# EAGLE design signal-board (EAGLE 9.6.2)
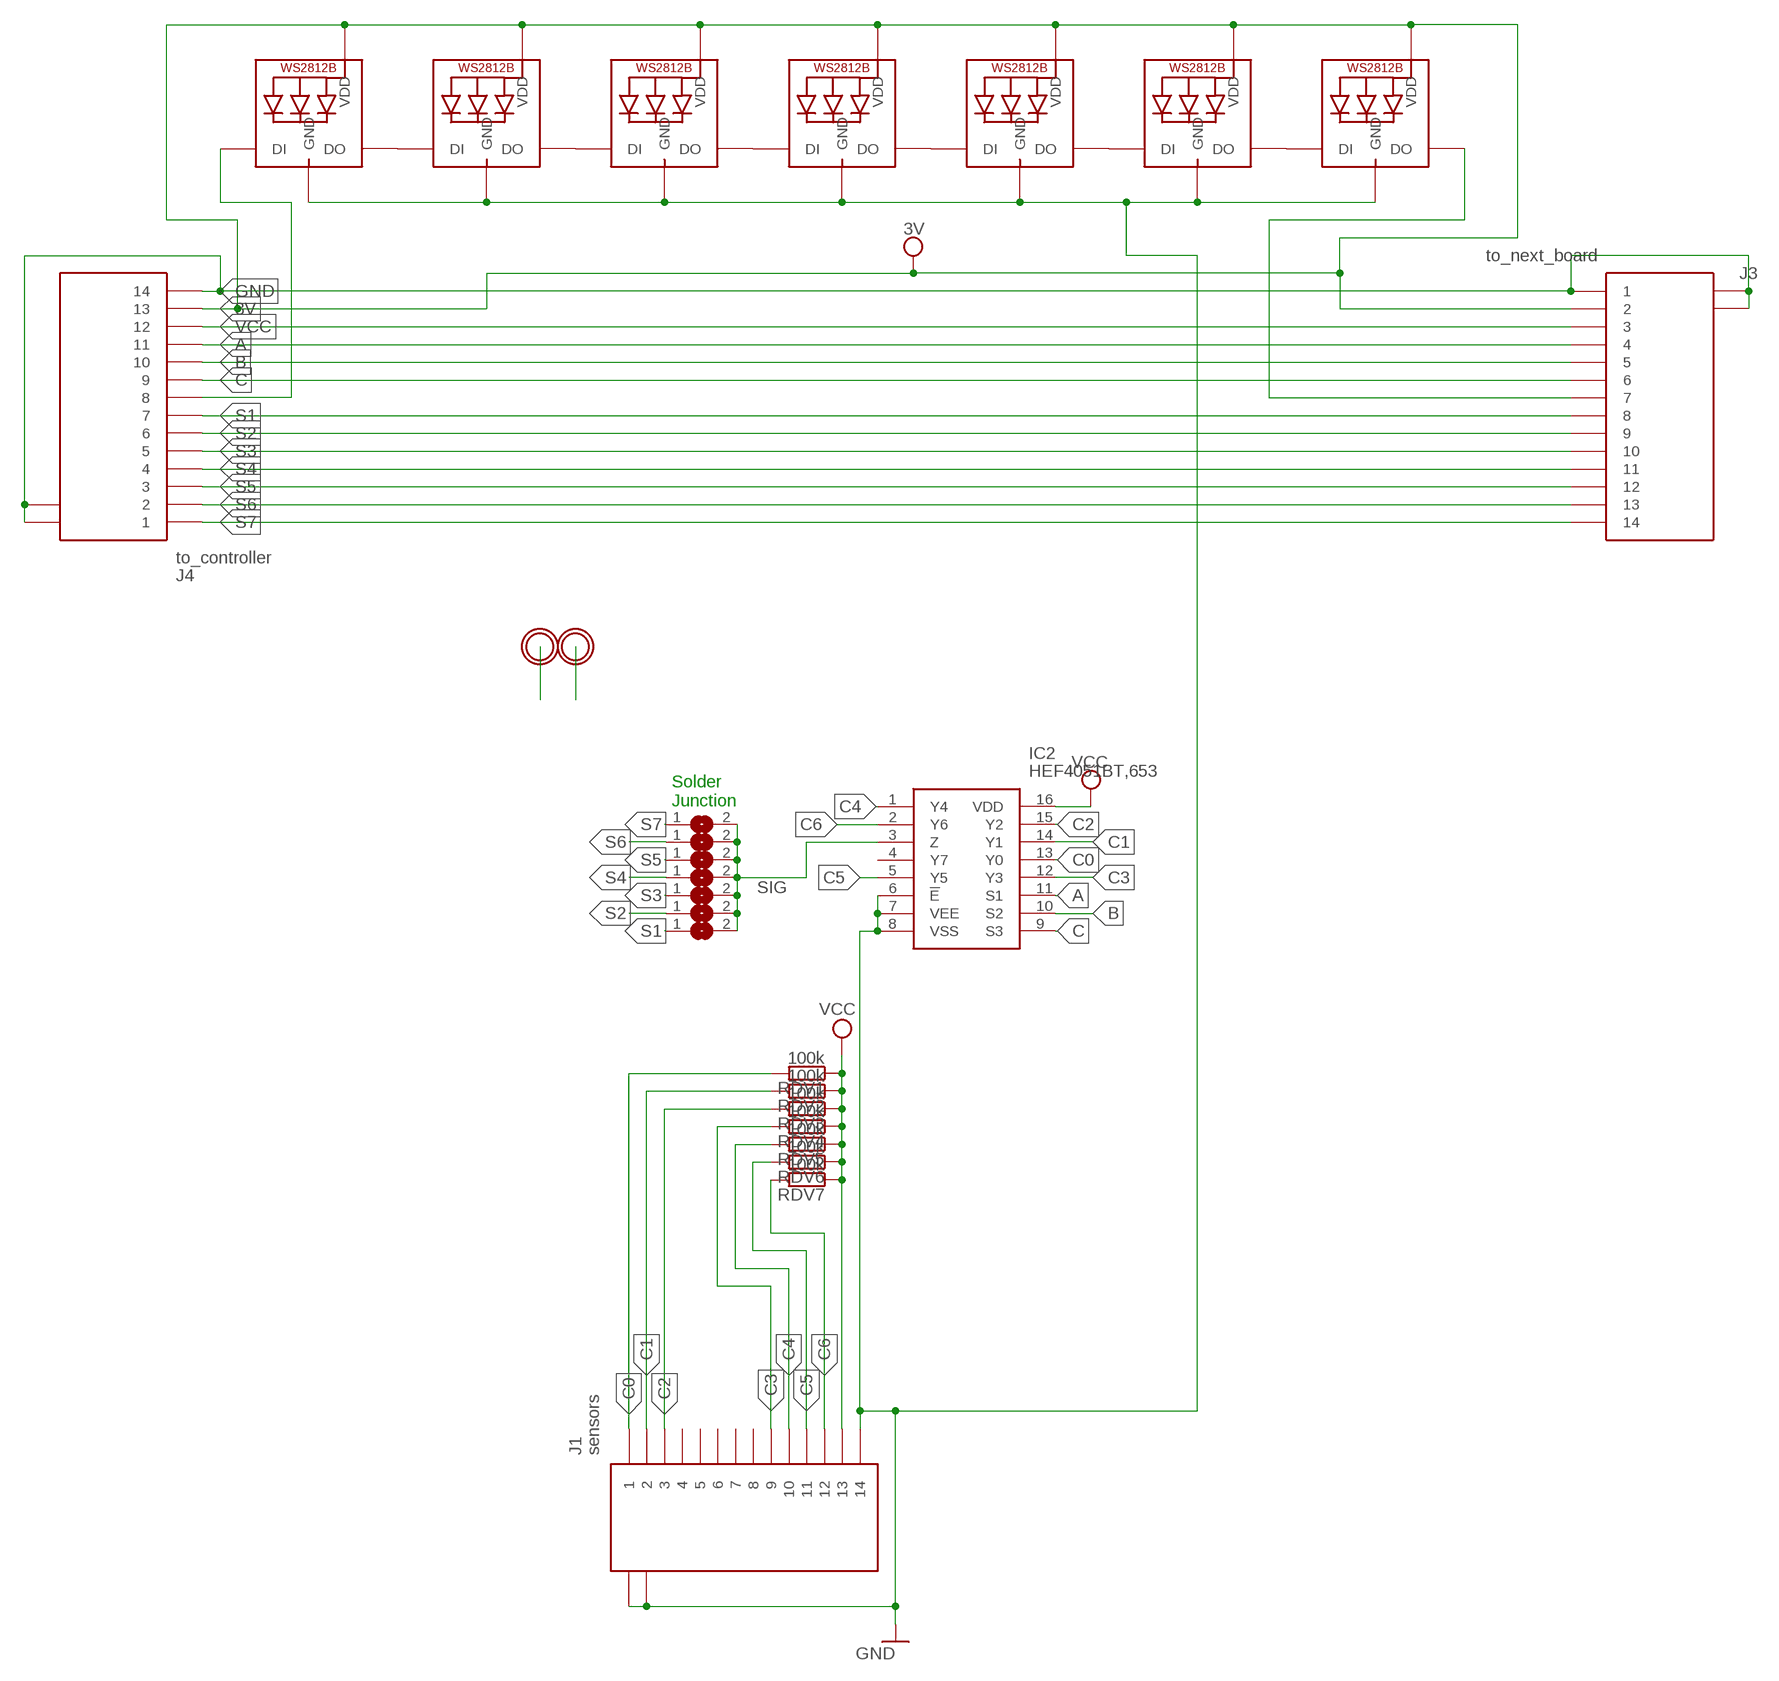
[diagram p0: schematic, sheet 1]

## Parts
IC2  HEF4051BT,653  [HEF4051BT653]
J1  sensors  686114148922  [686114148922]
J3  to_next_board  686114148922  [686114148922]
J4  to_controller  686114148922  [686114148922]
LED1  WS2812B3535  [LED3535]
LED2  WS2812B3535  [LED3535]
LED3  WS2812B3535  [LED3535]
LED4  WS2812B3535  [LED3535]
LED5  WS2812B3535  [LED3535]
LED6  WS2812B3535  [LED3535]
LED7  WS2812B3535  [LED3535]
RDV1  100k  R-EU_R0805  [R0805]
RDV2  100k  R-EU_R0805  [R0805]
RDV3  100k  R-EU_R0805  [R0805]
RDV4  100k  R-EU_R0805  [R0805]
RDV5  100k  R-EU_R0805  [R0805]
RDV6  100k  R-EU_R0805  [R0805]
RDV7  100k  R-EU_R0805  [R0805]
SJ1  SJ  [SJ]
SJ2  SJ  [SJ]
SJ3  SJ  [SJ]
SJ4  SJ  [SJ]
SJ5  SJ  [SJ]
SJ6  SJ  [SJ]
SJ7  SJ  [SJ]
U$1  MICROBUILDER_MOUNTINGHOLEMICROBUILDER_MOUNTINGHOL_4.0  [MICROBUILDER_MOUNTINGHOLE_4.0_PLATEDTHIN]
U$2  MICROBUILDER_MOUNTINGHOLEMICROBUILDER_MOUNTINGHOL_4.0  [MICROBUILDER_MOUNTINGHOLE_4.0_PLATEDTHIN]

## Nets
3V: J3.2 J4.13 LED1.2(VDD) LED2.2(VDD) LED3.2(VDD) LED4.2(VDD) LED5.2(VDD) LED6.2(VDD) LED7.2(VDD)
A: IC2.11(S1) J3.4 J4.11
B: IC2.10(S2) J3.5 J4.10
C: IC2.9(S3) J3.6 J4.9
C0: IC2.13(Y0) J1.1 RDV1.2
C1: IC2.14(Y1) J1.2 RDV2.2
C2: IC2.15(Y2) J1.3 RDV3.2
C3: IC2.12(Y3) J1.9 RDV4.2
C4: IC2.1(Y4) J1.10 RDV5.2
C5: IC2.5(Y5) J1.11 RDV6.2
C6: IC2.2(Y6) J1.12 RDV7.2
DIN: J4.8 LED1.1(DI)
DOUT: J3.7 LED7.3(DO)
GND: IC2.6(!E) IC2.7(VEE) IC2.8(VSS) J1.14 J1.MP1 J1.MP2 J3.1 J3.MP1 J3.MP2 J4.14 J4.MP1 J4.MP2 LED1.4(GND) LED2.4(GND) LED3.4(GND) LED4.4(GND) LED5.4(GND) LED6.4(GND) LED7.4(GND)
N$1: LED1.3(DO) LED2.1(DI)
N$2: LED2.3(DO) LED3.1(DI)
N$3: LED3.3(DO) LED4.1(DI)
N$4: LED4.3(DO) LED5.1(DI)
N$5: LED5.3(DO) LED6.1(DI)
N$6: LED6.3(DO) LED7.1(DI)
S1: J3.8 J4.7 SJ1.1
S2: J3.9 J4.6 SJ2.1
S3: J3.10 J4.5 SJ3.1
S4: J3.11 J4.4 SJ4.1
S5: J3.12 J4.3 SJ5.1
S6: J3.13 J4.2 SJ6.1
S7: J3.14 J4.1 SJ7.1
SIG: IC2.3(Z) SJ1.2 SJ2.2 SJ3.2 SJ4.2 SJ5.2 SJ6.2 SJ7.2
VCC: IC2.16(VDD) J1.13 J3.3 J4.12 RDV1.1 RDV2.1 RDV3.1 RDV4.1 RDV5.1 RDV6.1 RDV7.1
Unconnected: IC2.4(Y7) J1.4 J1.5 J1.6 J1.7 J1.8

## Notes on the sheet
- Solder
  Junction

## Library data of the parts
IC2 = HEF4051BT_653:HEF4051BT,653: HEF4051B - 8-channel analog multiplexer/demultiplexer@en-us Source: Datasheet <https://assets.nexperia.com/documents/data-sheet/HEF4051B.pdf>; DESCRIPTION: HEF4051B - 8-channel analog multiplexer/demultiplexer@en-us; HEIGHT: 1.75mm; MANUFACTURER_NAME: Nexperia; MANUFACTURER_PART_NUMBER: HEF4051BT,653; MOUSER_PART_NUMBER: 771-HEF4051BTD-T; MOUSER_PRICE-STOCK: https://www.mouser.co.uk/ProductDetail/Nexperia/HEF4051BT653?qs=me8TqzrmIYWoNumSZf8zVw%3D%3D
J1 J3 J4 = 686114148922:686114148922: Wurth Elektronik WR-FPC 1mm Pitch 14 Way Horizontal SMT Female FPC Connector, ZIF Bottom Contact Source: Datasheet <https://www.we-online.com/catalog/datasheet/686114148922.pdf>; DESCRIPTION: Wurth Elektronik WR-FPC 1mm Pitch 14 Way Horizontal SMT Female FPC Connector, ZIF Bottom Contact; HEIGHT: 2.3mm; MANUFACTURER_NAME: Wurth Elektronik; MANUFACTURER_PART_NUMBER: 686114148922; MOUSER_PART_NUMBER: 710-686114148922; MOUSER_PRICE-STOCK: https://www.mouser.co.uk/ProductDetail/Wurth-Elektronik/686114148922?qs=a9WhcLg8qCz0mPj5zZqo5g%3D%3D
LED1-LED7 = adafruit:WS2812B
RDV1-RDV7 = rcl:R-EU_: RESISTOR, European symbol; SPICEPREFIX: R
SJ1-SJ7 = jumper:SJ: SMD solder JUMPER
U$1 U$2 = microbuilder:MICROBUILDER_MOUNTINGHOLE: Mounting Hole For #2 screws (0.086"/2.18mm width, 0.094"/2.4mm hole) use 2.5mm

## Board
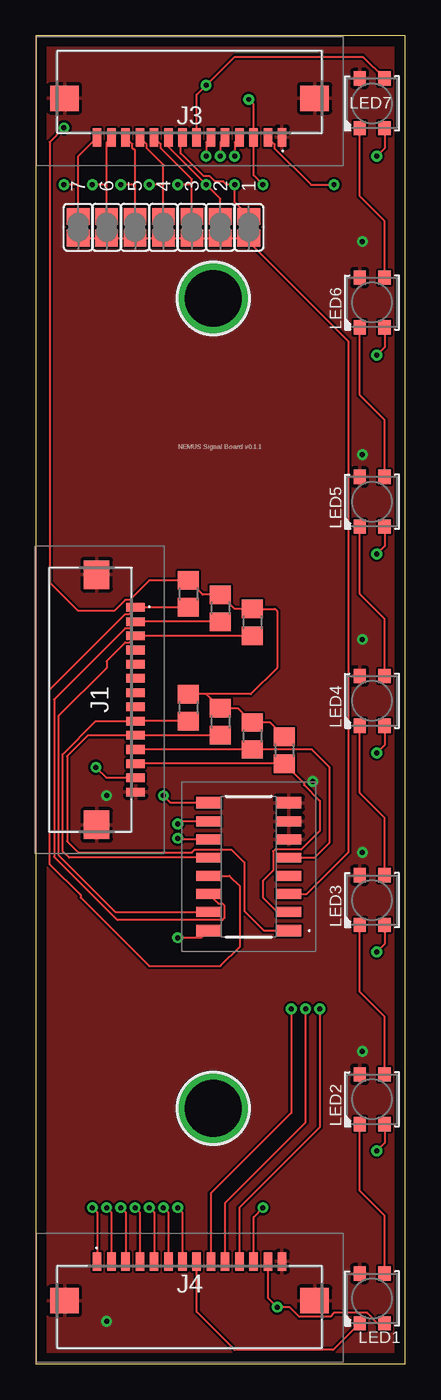
[diagram p1: board, top side]
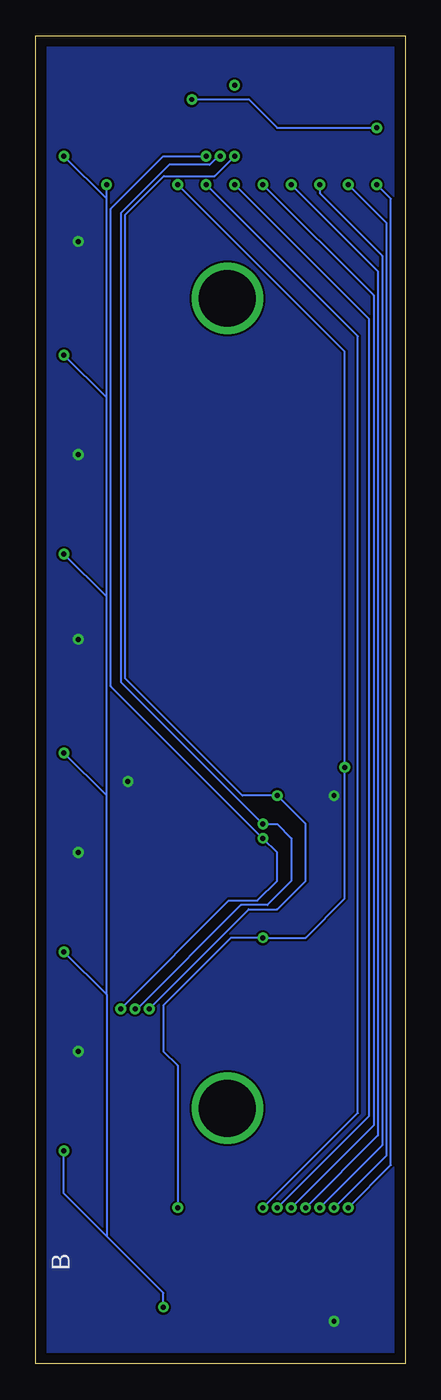
[diagram p2: board, bottom side, seen from below]

Size 26 x 93.5 mm. Coordinates in mm from the lower left corner, seen from the top.
Outline: 0,0 26,0 26,93.5 0,93.5 0,0
Copper layers (1*16): Top 0.035mm / dielectric 1.5mm / Bottom 0.035mm
Design rules "default *": minimum track width 6mil, minimum drill 0.35mm, track to track 6mil, track to pad 6mil, pad to pad 6mil, via to via 6mil, smd to smd 6mil, copper to edge 30mil, drill to drill 6mil, minimum pad ring 10mil, minimum via ring 8mil, stop-mask expansion 4mil, vias tented up to drill 0mil, thermal gap 10mil

### Footprints (pad centres in the part's own frame; a part is rotated, then mirrored left to right if it is on the bottom)
HEF4051BT653 = smd 0.8 x 1.75: 1 -4.495,-2.825; 8 4.495,-2.825; 9 4.495,2.825; 16 -4.495,2.825 | smd 0.7 x 1.75: 2 -3.175,-2.825; 3 -1.905,-2.825; 4 -0.635,-2.825; 5 0.635,-2.825; 6 1.905,-2.825; 7 3.175,-2.825; 10 3.175,2.825; 11 1.905,2.825; 12 0.635,2.825; 13 -0.635,2.825; 14 -1.905,2.825; 15 -3.175,2.825
686114148922 = smd 0.6 x 1.3: 1 -6.5,3.05; 2 -5.5,3.05; 3 -4.5,3.05; 4 -3.5,3.05; 5 -2.5,3.05; 6 -1.5,3.05; 7 -0.5,3.05; 8 0.5,3.05; 9 1.5,3.05; 10 2.5,3.05; 11 3.5,3.05; 12 4.5,3.05; 13 5.5,3.05; 14 6.5,3.05 | smd 2 x 1.8: MP1 -8.8,0.3; MP2 8.8,0.3
LED3535 = smd 1 x 0.85: 1 -1.75,0.875; 2 -1.75,-0.875; 3 1.75,-0.875; 4 1.75,0.875
R0805 = smd 1.3 x 1.5: 1 -0.95,0; 2 0.95,0
SJ = smd 1.168 x 1.6: 1 -0.762,0; 2 0.762,0
MICROBUILDER_MOUNTINGHOLE_4.0_PLATEDTHIN = drill 4 pad 4.6: P$1 0,0

### Placement (x,y rotation side)
IC2  15,35 90 top
J1  4,46.75 270 top
J3  10.84,89.38 180 top
J4  10.84,4.16 0 top
LED1  23.68,4.61 90 top
LED2  23.68,18.63 90 top
LED3  23.68,32.65 90 top
LED4  23.68,46.67 90 top
LED5  23.68,60.69 90 top
LED6  23.68,74.71 90 top
LED7  23.68,88.73 90 top
RDV1  10.75,54.2 270 top
RDV2  13,53.2 270 top
RDV3  15.25,52.2 270 top
RDV4  10.75,46.2 270 top
RDV5  13,45.2 270 top
RDV6  15.25,44.2 270 top
RDV7  17.5,43.2 270 top
SJ1  15,80 270 top
SJ2  13,80 270 top
SJ3  11,80 270 top
SJ4  9,80 270 top
SJ5  7,80 270 top
SJ6  5,80 270 top
SJ7  3,80 270 top
U$1  12.5,75 0 top
U$2  12.5,18 0 top

### Tracks (layer width: path | path; a pad name or v marks a point on that pad's centre or on a via)
3V  (via drill 0.35)
  Top 0.152: J4.13 16.34,4.66 v17,4 17.88,4 18.55,3.33 20.73,3.33 20.99,3.59 23.32,3.59 24.05,2.86 LED1.2 | J3.2 16.81,85.86 16.81,85.58 19.4,83 v21,83 | LED2.2 24.55,15.55 v24,15 | LED3.2 24.55,29.55 v24,29 | LED4.2 24.55,43.55 v24,43 | LED5.2 24.55,57.55 v24,57 | LED6.2 24.55,71.56 v24,71 | LED7.2 24.55,85.56 v24,85
  Bottom 0.152: 21,26 21,40 | 21,40 21,54 | 21,54 21,68 | 21,68 21,82 | 21,82 v21,83 | v24,15 24,12 21,9 | v24,29 21,26 | v24,43 21,40 | v24,57 21,54 | v24,71 21,68 | v24,85 21,82 | v17,4 17,5 21,9 | 21,26 21,9
A  (via drill 0.35)
  Top 0.152: IC2.11 10.1,36.91 v10,37 | J4.11 14.34,11 20,16.66 v20,25 | J3.4 14,85.99 v14,85
  Bottom 0.152: v14,85 17,85 20.7,81.31 20.7,47.7 v10,37 9,36 9,34 10.39,32.61 12.39,32.61 v20,25
B  (via drill 0.35)
  Top 0.152: IC2.10 10.18,38.17 v10,38 | J3.5 13,85.99 v13,85 | v19,25 19,17 13.34,11.34 J4.10
  Bottom 0.152: v19,25 18.86,25 11.55,32.3 9.7,32.3 8,34 8,37 9,38 v10,38 20,48 20,81 16.61,84.39 13.75,84.39 13.14,85 v13,85
C  (via drill 0.35)
  Top 0.152: IC2.9 9.51,39.49 v9,40 | J4.9 12.34,12 18,17.66 v18,25 | J3.6 12,85.99 v12,85
  Bottom 0.152: v18,25 11,32 9,32 7,34 7,38 v9,40 11.45,40 19.7,48.25 19.7,80.87 16.96,83.61 13.39,83.61 v12,85
C0
  Top 0.152: RDV1.2 J1.1 6.58,52.78 6.3,52.78 1,47.47 1,35.17 3.17,33 3.17,32.83 8,28 13,28 14.39,29.39 14.39,33.61 13.63,34.37 IC2.13
C1
  Top 0.152: RDV2.2 J1.2 6.58,51.78 6.3,51.78 1.3,46.78 1.3,35.7 5.75,31.25 13.14,31.25 13.28,31.38 13.28,32.27 13.14,32.4 12.87,32.4 IC2.14
C2
  Top 0.152: RDV3.2 J1.3 6.58,50.78 6.3,50.78 5,49.47 5,49 1.61,45.61 1.61,35.82 5.61,31.82 IC2.15
C3
  Top 0.152: RDV4.2 J1.9 4.25,45.25 1.91,42.91 1.91,36.09 2.37,35.63 IC2.12
C4
  Top 0.152: RDV5.2 J1.10 3.68,44.25 2.22,42.79 2.22,36.78 3,36 10.99,36 11.21,36.21 13.79,36.21 14.7,35.3 14.7,31.87 16.06,30.5 IC2.1
C5
  Top 0.152: J1.11 RDV6.2 19.45,43.25 20.7,42 20.7,36.7 19.64,35.63 IC2.5
C6
  Top 0.152: J1.12 RDV7.2 18.89,40.86 18.89,40.75 20,39.64 20,37.53 18.68,36.21 16.86,36.21 16.72,36.08 16.72,34.72 16,34 16,32.83 17,31.82 IC2.2
DIN
  Top 0.152: LED1.1 20.95,1 14,1 11.34,3.66 J4.8
DOUT  (via drill 0.35)
  Top 0.152: J3.7 11.34,89.34 v12,90 14,92 23.04,92 LED7.3
GND  (via drill 0.35)
  other vias: 5,40 19.5,41 23,22 23,36 5,3 23,64 23,79 23,51
  pour Top: 0,93.5 26,93.5 26,0 0,0
  pour Bottom: 26,93.5 0,93.5 0,0 26,0
N$1
  Top 0.152: LED1.3 24.55,10.45 22.8,12.2 LED2.1
N$2
  Top 0.152: LED2.3 24.55,24.45 22.8,26.2 LED3.1
N$3
  Top 0.152: LED3.3 24.55,38.45 22.8,40.2 LED4.1
N$4
  Top 0.152: LED4.3 24.55,52.45 22.8,54.2 LED5.1
N$5
  Top 0.152: LED5.3 24.55,66.44 22.8,68.19 LED6.1
N$6
  Top 0.152: LED6.3 24.55,80.44 22.8,82.19 LED7.1
S1  (via drill 0.35)
  Top 0.152: v10,11 10.34,10.66 J4.7 | SJ1.1 14,81.76 v14,83 13.43,83 13.22,83.22 12.64,83.22 12.25,83.61 11.82,83.61 10.22,85.22 10.22,86.21 J3.8
  Bottom 0.152: v10,11 3.33,17.67 3.33,72.33 v14,83
S2  (via drill 0.35)
  Top 0.152: SJ2.1 13,82 v12,83 9.34,85.66 J3.9 | v9,11 9.34,10.66 J4.6
  Bottom 0.152: v9,11 2.52,17.48 2.52,73.52 v12,83
S3  (via drill 0.35)
  Top 0.152: J3.10 8.81,85.86 8.81,85.58 11,83.4 11,83 | SJ3.1 11,83 | 11,83 v10,83 | v8,11 8.34,10.66 J4.5
  Bottom 0.152: v8,11 2.22,16.78 2.22,75.22 v10,83
S4  (via drill 0.35)
  Top 0.152: J3.11 7.81,85.86 7.81,85.58 9,84.4 9,83 | SJ4.1 9,83 | 9,83 v8,83 | v7,11 7.34,10.66 J4.4
  Bottom 0.152: v7,11 1.91,16.09 1.91,76.91 v8,83
S5  (via drill 0.35)
  Top 0.152: J3.12 6.81,85.86 6.81,85.58 7,85.4 7,83 | SJ5.1 7,83 | 7,83 v6,83 | v6,11 6.34,10.66 J4.3
  Bottom 0.152: v6,11 1.61,15.39 1.61,78 6,82.39 v6,83
S6  (via drill 0.35)
  Top 0.152: SJ6.1 5,83 | 5,83 5,85.99 J3.13 | 5,83 v4,83 | v5,11 5.34,10.66 J4.2
  Bottom 0.152: v4,83 1.3,80.31 1.3,14.7 v5,11
S7  (via drill 0.35)
  Top 0.152: SJ7.1 3,83 | 3,83 3,84.99 J3.14 | 3,83 v2,83 | v4,11 4.34,10.66 J4.1
  Bottom 0.152: v2,83 1,82 1,14 v4,11
SIG
  Top 0.152: SJ7.2 SJ6.2 SJ5.2 SJ4.2 SJ3.2 SJ2.2 SJ1.2 15,79 22,72 22,36 19.09,33.09 IC2.3
VCC  (via drill 0.35)
  Top 0.152: RDV7.1 16.5,45.15 RDV6.1 14.25,46.15 RDV5.1 12,47.15 RDV4.1 15.15,47.15 17,49 17,53 16.85,53.15 RDV3.1 14,53.15 RDV2.1 11.75,54.15 RDV1.1 8,55.15 6.63,53.78 6.3,53.78 5.53,53 3,53 1,55 1,86 v2,87 | v15,89 15.34,88.66 J3.3 15.34,83.66 v16,83 | J1.13 5,41.25 v4.25,42 | IC2.16 11.67,30 v10,30 | J4.12 15.34,10.34 v16,11
  Bottom 0.152: v2,87 9,87 11,89 v15,89 | v16,83 4.25,71.25 v4.25,42 4.25,32.75 7,30 v10,30 12.25,30 17,25.25 17,22 16,21 v16,11

### Text on the board
tNames: 7 | 6 | 5 | 4 | 3 | 2 | 1 | NEMUS Signal Board v0.1.1
bNames: B